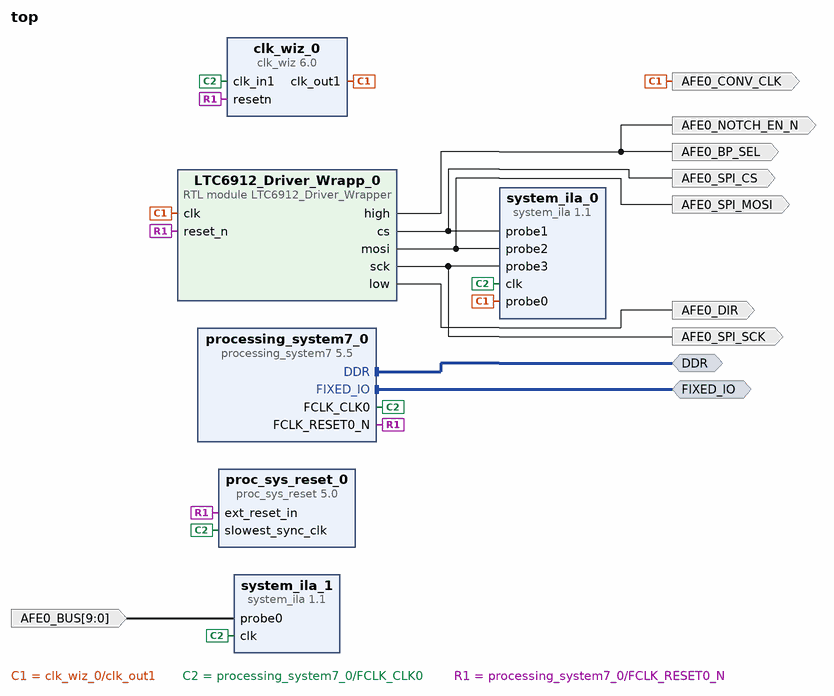
[diagram p0: block diagram of the top level]
# Vivado block design top, xc7z020clg400-1, Vivado 2023.2
create_bd_design top

create_bd_intf_port -mode Master -vlnv xilinx.com:interface:ddrx_rtl:1.0 DDR
create_bd_intf_port -mode Master -vlnv xilinx.com:display_processing_system7:fixedio_rtl:1.0 FIXED_IO
create_bd_port -dir O AFE0_CONV_CLK
create_bd_port -dir O AFE0_SPI_CS
create_bd_port -dir O AFE0_SPI_SCK
create_bd_port -dir O AFE0_SPI_MOSI
create_bd_port -dir O -type data AFE0_NOTCH_EN_N
create_bd_port -dir O AFE0_DIR
create_bd_port -dir O AFE0_BP_SEL
create_bd_port -dir I -from 9 -to 0 AFE0_BUS

create_bd_cell -type ip -vlnv xilinx.com:ip:processing_system7:5.5 processing_system7_0
set_property -dict [list \
  CONFIG.PCW_APU_PERIPHERAL_FREQMHZ 667 \
  CONFIG.PCW_ENET0_ENET0_IO {MIO 16 .. 27} \
  CONFIG.PCW_ENET0_GRP_MDIO_ENABLE 1 \
  CONFIG.PCW_ENET0_GRP_MDIO_IO {MIO 52 .. 53} \
  CONFIG.PCW_ENET0_PERIPHERAL_ENABLE 1 \
  CONFIG.PCW_ENET0_RESET_ENABLE 0 \
  CONFIG.PCW_ENET_RESET_ENABLE 1 \
  CONFIG.PCW_ENET_RESET_SELECT {Share reset pin} \
  CONFIG.PCW_FPGA0_PERIPHERAL_FREQMHZ 100 \
  CONFIG.PCW_FPGA1_PERIPHERAL_FREQMHZ 50 \
  CONFIG.PCW_GPIO_EMIO_GPIO_ENABLE 1 \
  CONFIG.PCW_GPIO_EMIO_GPIO_IO 64 \
  CONFIG.PCW_GPIO_MIO_GPIO_ENABLE 1 \
  CONFIG.PCW_GPIO_MIO_GPIO_IO MIO \
  CONFIG.PCW_I2C_RESET_ENABLE 1 \
  CONFIG.PCW_PERIPHERAL_BOARD_PRESET part0 \
  CONFIG.PCW_PRESET_BANK1_VOLTAGE {LVCMOS 1.8V} \
  CONFIG.PCW_QSPI_GRP_SINGLE_SS_ENABLE 1 \
  CONFIG.PCW_QSPI_GRP_SINGLE_SS_IO {MIO 1 .. 6} \
  CONFIG.PCW_QSPI_PERIPHERAL_ENABLE 1 \
  CONFIG.PCW_QSPI_QSPI_IO {MIO 1 .. 6} \
  CONFIG.PCW_SD0_GRP_CD_ENABLE 1 \
  CONFIG.PCW_SD0_GRP_CD_IO {MIO 46} \
  CONFIG.PCW_SD0_GRP_WP_ENABLE 1 \
  CONFIG.PCW_SD0_GRP_WP_IO {MIO 47} \
  CONFIG.PCW_SD0_PERIPHERAL_ENABLE 1 \
  CONFIG.PCW_SD0_SD0_IO {MIO 40 .. 45} \
  CONFIG.PCW_SDIO_PERIPHERAL_FREQMHZ 50 \
  CONFIG.PCW_SINGLE_QSPI_DATA_MODE x4 \
  CONFIG.PCW_TTC0_PERIPHERAL_ENABLE 1 \
  CONFIG.PCW_TTC0_TTC0_IO EMIO \
  CONFIG.PCW_UART1_PERIPHERAL_ENABLE 1 \
  CONFIG.PCW_UART1_UART1_IO {MIO 48 .. 49} \
  CONFIG.PCW_UART_PERIPHERAL_FREQMHZ 100 \
  CONFIG.PCW_UIPARAM_DDR_FREQ_MHZ 533.333333 \
  CONFIG.PCW_UIPARAM_DDR_PARTNO {MT41K128M16 HA-15E} \
  CONFIG.PCW_USB0_PERIPHERAL_ENABLE 1 \
  CONFIG.PCW_USB0_RESET_ENABLE 1 \
  CONFIG.PCW_USB0_RESET_IO {MIO 7} \
  CONFIG.PCW_USB0_USB0_IO {MIO 28 .. 39} \
  CONFIG.PCW_USB_RESET_ENABLE 1 \
  CONFIG.PCW_USB_RESET_SELECT {Share reset pin} \
  CONFIG.PCW_USE_M_AXI_GP0 0 \
  CONFIG.preset None \
] [get_bd_cells processing_system7_0]
# 497 more settings of processing_system7_0 are not shown: defaults, MIO pin electricals, DDR timing, and values the tool derives
create_bd_cell -type ip -vlnv xilinx.com:ip:proc_sys_reset:5.0 proc_sys_reset_0
create_bd_cell -type ip -vlnv xilinx.com:ip:clk_wiz:6.0 clk_wiz_0
set_property -dict [list \
  CONFIG.CLKOUT1_JITTER 290.478 \
  CONFIG.CLKOUT1_PHASE_ERROR 133.882 \
  CONFIG.CLKOUT1_REQUESTED_OUT_FREQ 10.000 \
  CONFIG.MMCM_CLKFBOUT_MULT_F 15.625 \
  CONFIG.MMCM_CLKOUT0_DIVIDE_F 78.125 \
  CONFIG.MMCM_DIVCLK_DIVIDE 2 \
  CONFIG.RESET_PORT resetn \
  CONFIG.RESET_TYPE ACTIVE_LOW \
] [get_bd_cells clk_wiz_0]
create_bd_cell -type module -reference LTC6912_Driver_Wrapper LTC6912_Driver_Wrapp_0
create_bd_cell -type ip -vlnv xilinx.com:ip:system_ila:1.1 system_ila_0
set_property -dict [list \
  CONFIG.C_DATA_DEPTH 131072 \
  CONFIG.C_MON_TYPE NATIVE \
  CONFIG.C_NUM_OF_PROBES 5 \
  CONFIG.C_PROBE0_TYPE 0 \
  CONFIG.C_PROBE1_TYPE 0 \
  CONFIG.C_PROBE2_TYPE 0 \
  CONFIG.C_PROBE3_TYPE 0 \
  CONFIG.C_PROBE4_TYPE 0 \
] [get_bd_cells system_ila_0]
create_bd_cell -type ip -vlnv xilinx.com:ip:system_ila:1.1 system_ila_1
set_property -dict [list \
  CONFIG.C_ADV_TRIGGER true \
  CONFIG.C_DATA_DEPTH 131072 \
  CONFIG.C_EN_STRG_QUAL 1 \
  CONFIG.C_MON_TYPE NATIVE \
  CONFIG.C_NUM_OF_PROBES 1 \
  CONFIG.C_PROBE0_TYPE 0 \
  CONFIG.C_PROBE0_WIDTH 10 \
  CONFIG.C_PROBE_WIDTH_PROPAGATION MANUAL \
] [get_bd_cells system_ila_1]

# ---- connections ----

connect_bd_intf_net [get_bd_intf_ports DDR] [get_bd_intf_pins processing_system7_0/DDR]
connect_bd_intf_net [get_bd_intf_ports FIXED_IO] [get_bd_intf_pins processing_system7_0/FIXED_IO]
connect_bd_net [get_bd_ports AFE0_BUS] [get_bd_pins system_ila_1/probe0]
connect_bd_net -net LTC6912_Driver_Wrapp_0_cs [get_bd_pins LTC6912_Driver_Wrapp_0/cs] [get_bd_ports AFE0_SPI_CS] [get_bd_pins system_ila_0/probe1]
connect_bd_net [get_bd_pins LTC6912_Driver_Wrapp_0/high] [get_bd_ports AFE0_NOTCH_EN_N] [get_bd_ports AFE0_BP_SEL]
connect_bd_net [get_bd_pins LTC6912_Driver_Wrapp_0/low] [get_bd_ports AFE0_DIR]
connect_bd_net -net LTC6912_Driver_Wrapp_0_mosi [get_bd_pins LTC6912_Driver_Wrapp_0/mosi] \
  [get_bd_ports AFE0_SPI_MOSI] [get_bd_pins system_ila_0/probe2]
connect_bd_net -net LTC6912_Driver_Wrapp_0_sck [get_bd_pins LTC6912_Driver_Wrapp_0/sck] [get_bd_ports AFE0_SPI_SCK] [get_bd_pins system_ila_0/probe3]
connect_bd_net -net clk_wiz_0_clk_out1 [get_bd_pins clk_wiz_0/clk_out1] \
  [get_bd_ports AFE0_CONV_CLK] [get_bd_pins system_ila_0/probe0] [get_bd_pins LTC6912_Driver_Wrapp_0/clk]
connect_bd_net [get_bd_pins processing_system7_0/FCLK_CLK0] \
  [get_bd_pins proc_sys_reset_0/slowest_sync_clk] [get_bd_pins clk_wiz_0/clk_in1] [get_bd_pins system_ila_1/clk] \
  [get_bd_pins system_ila_0/clk]
connect_bd_net [get_bd_pins processing_system7_0/FCLK_RESET0_N] \
  [get_bd_pins proc_sys_reset_0/ext_reset_in] [get_bd_pins clk_wiz_0/resetn] [get_bd_pins LTC6912_Driver_Wrapp_0/reset_n]
set_property HDL_ATTRIBUTE.DEBUG true [get_bd_nets LTC6912_Driver_Wrapp_0_cs]
set_property HDL_ATTRIBUTE.MARK_DEBUG true [get_bd_nets LTC6912_Driver_Wrapp_0_cs]
set_property HDL_ATTRIBUTE.DEBUG true [get_bd_nets LTC6912_Driver_Wrapp_0_mosi]
set_property HDL_ATTRIBUTE.MARK_DEBUG true [get_bd_nets LTC6912_Driver_Wrapp_0_mosi]
set_property HDL_ATTRIBUTE.DEBUG true [get_bd_nets LTC6912_Driver_Wrapp_0_sck]
set_property HDL_ATTRIBUTE.MARK_DEBUG true [get_bd_nets LTC6912_Driver_Wrapp_0_sck]
set_property HDL_ATTRIBUTE.DEBUG true [get_bd_nets clk_wiz_0_clk_out1]
set_property HDL_ATTRIBUTE.MARK_DEBUG true [get_bd_nets clk_wiz_0_clk_out1]

validate_bd_design
save_bd_design
